# Altium schematic sheet MCU_MKE185F512VLH16.SchDoc: Microcontroller
size A4; DrawnBy: Not Alvin Ha; DocumentNumber: MCU2018-2; Revision: 2.0; SheetNumber: 2; SheetTotal: 4
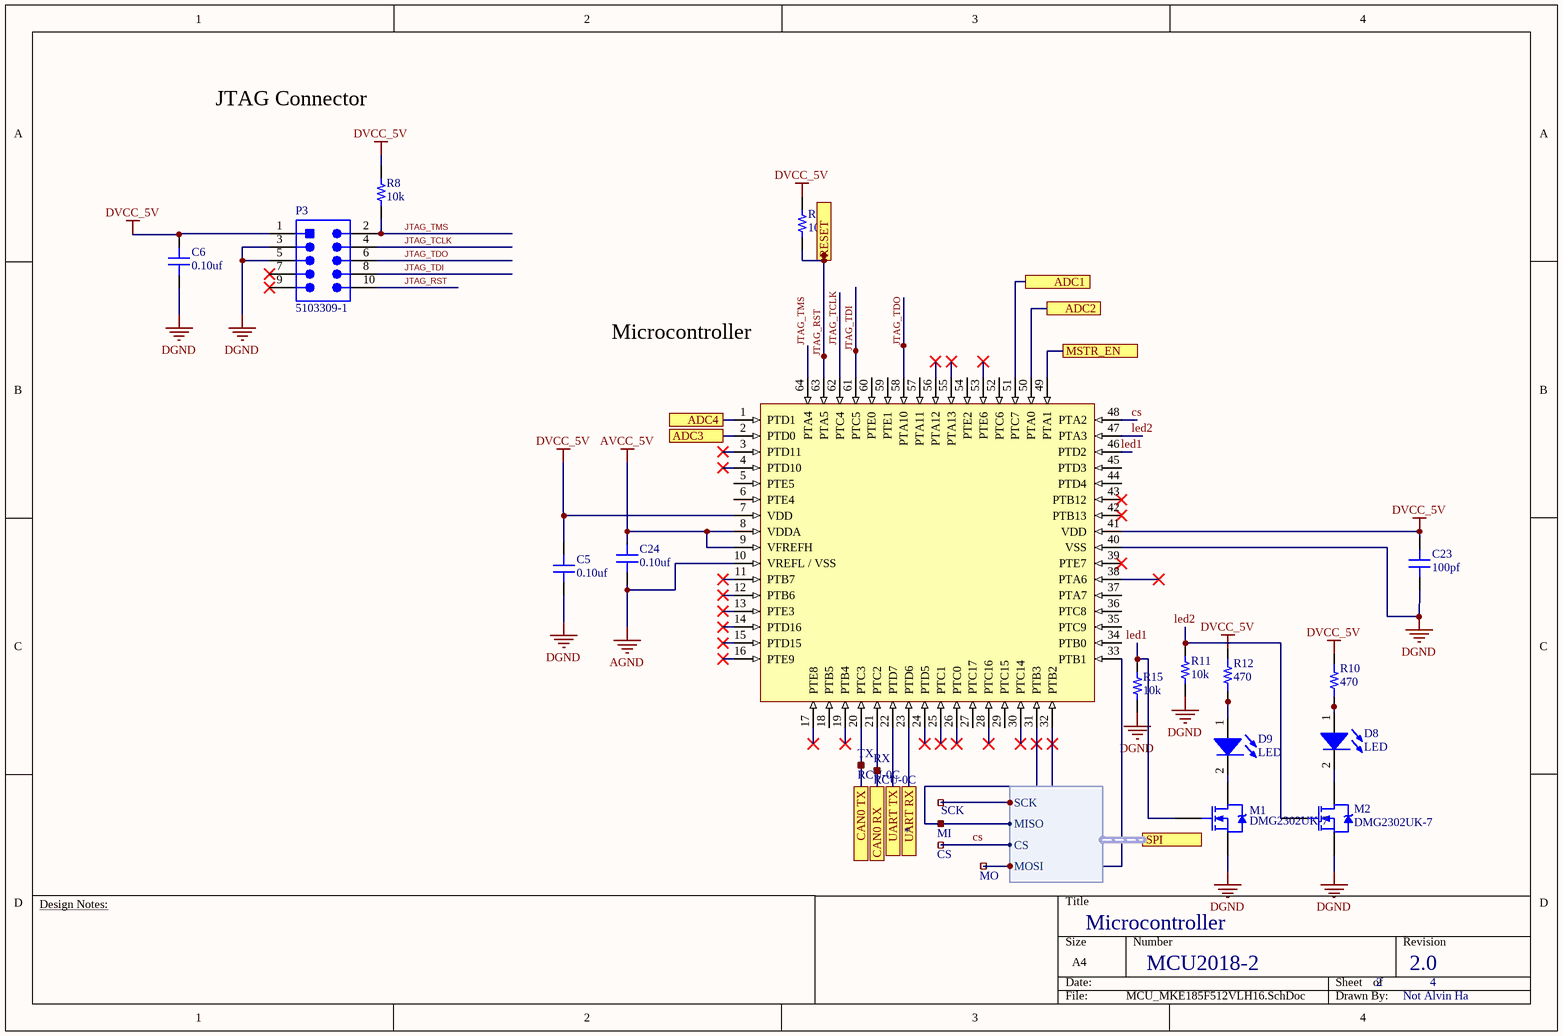
[diagram p0: MCU_MKE185F512VLH16.SchDoc]

## Parts
C5  value 0.10uf  [CAP 0603/1608]  (hidden comment: Capacitor MLCC 0.10uf 25V CAP 0603/1608)
C6  value 0.10uf  [CAP 0603/1608]  (hidden comment: Capacitor MLCC 0.10uf 16V CAP 0603/1608)
C23  value 100pf  [CAP 0603/1608]  (hidden comment: Capacitor MLCC 100pf 25V CAP 0603/1608)
C24  value 0.10uf  [CAP 0603/1608]  (hidden comment: Capacitor MLCC 0.10uf 25V CAP 0603/1608)
CS  RCU-0C  [RCU-0C]  (value not drawn)
D8  LED  [0805_LED]
D9  LED  [0805_LED]
M1  DMG2302UK-7  [SOT23-3]
M2  DMG2302UK-7  [SOT23-3]
MI  RCU-0C  [RCU-0C]  (value not drawn)
MO  RCU-0C  [RCU-0C]  (value not drawn)
P3  5103309-1  [HDR2X5_SMT]
R8  value 10k  [RES 0603/1608]  (hidden comment: Resistor 10k 0603 1/10W 1%)
R9  value 10k  [RES 0603/1608]  (hidden comment: Resistor 10k 0603 1/10W 5%)
R10  value 470  [RES 0603/1608]  (hidden comment: Resistor 470 0603 1/10W 5%)
R11  value 10k  [RES 0603/1608]  (hidden comment: Resistor 10k 0603 1/10W 1%)
R12  value 470  [RES 0603/1608]  (hidden comment: Resistor 470 0603 1/10W 5%)
R15  value 10k  [RES 0603/1608]  (hidden comment: Resistor 10k 0603 1/10W 1%)
RX  RCU-0C  [RCU-0C]
SCK  RCU-0C  [RCU-0C]  (value not drawn)
TX  RCU-0C  [RCU-0C]
U7  (no value)  [TQFP64]

## Ports
ADC1, ADC2, ADC3, ADC4, CAN0 RX, CAN0 TX, MSTR_EN, RESET, SPI (harness *), UART RX, UART TX

## Harnesses
*: SCK, MISO, CS, MOSI

## Nets
AGND: C24.1 U7.10(VREFL_/_VSS)
AVCC_5V: C24.2 U7.8(VDDA) U7.9(VFREFH)
DGND: C5.1 C6.1 C23.1 M1.2(S) M2.2(S) P3.3 P3.5 R11.1 R15.1 U7.40(VSS)
DVCC_5V: C5.2 C6.2 C23.2 P3.1 R8.2 R9.2 R10.2 R12.2 U7.7(VDD) U7.41(VDD)
ADC1: U7.51(PTC7) ; port ADC1
ADC2: U7.50(PTA0) ; port ADC2
ADC3: U7.2(PTD0) ; port ADC3
ADC4: U7.1(PTD1) ; port ADC4
CAN0 RX: RX.1 U7.21(PTC2) ; port CAN0 RX
CAN0 TX: TX.1 U7.20(PTC3) ; port CAN0 TX
cs: CS.1 U7.48(PTA2) ; port SPI.CS
JTAG_RST: P3.10 R9.1 U7.63(PTA5) ; port RESET
JTAG_TCLK: P3.4 U7.62(PTC4)
JTAG_TDI: P3.8 U7.61(PTC5)
JTAG_TDO: P3.6 U7.58(PTA10)
JTAG_TMS: P3.2 R8.1 U7.64(PTA4)
led1: M1.1(G) R15.2 U7.46(PTD2)
led2: M2.1(G) R11.2 U7.47(PTA3)
MSTR_EN: U7.49(PTA1) ; port MSTR_EN
UART RX: U7.23(PTD6) ; port UART RX
UART TX: U7.22(PTD7) ; port UART TX
NetD8_1: D8.1(A) R10.1
NetD8_2: D8.2(K) M2.3(D)
NetD9_1: D9.1(A) R12.1
NetD9_2: D9.2(K) M1.3(D)
NetMI_1: MI.1 U7.31(PTB3) ; port SPI.MISO
NetMO_1: MO.1 U7.33(PTB1) ; port SPI.MOSI
NetSCK_1: SCK.1 U7.32(PTB2) ; port SPI.SCK

Not connected (* = marked no-connect by the designer): P3 7* 9*; U7 3(PTD11)* 4(PTD10)* 5(PTE5) 6(PTE4) 11(PTB7)* 12(PTB6)* 13(PTE3)* 14(PTD16)* 15(PTD15)* 16(PTE9)* 17(PTE8)* 18(PTB5) 19(PTB4)* 24(PTD5)* 25(PTC1)* 26(PTC0)* 27(PTC17) 28(PTC16)* 29(PTC15) 30(PTC14)* 34(PTB0) 35(PTC9) 36(PTC8) 37(PTA7) 38(PTA6)* 39(PTE7)* 42(PTB13)* 43(PTB12)* 44(PTD4) 45(PTD3) 52(PTC6) 53(PTE6)* 54(PTE2) 55(PTA13)* 56(PTA12)* 57(PTA11) 59(PTE1) 60(PTE0)

## Notes on the sheet
- JTAG Connector
- Microcontroller
- Design Notes:

## Library data of the parts
C5 C24 = 583: Manufacturer_id: 1; idCapacitor: 583; Name: Cap_0.10uf_25V_CAP 0603/1608; Dielectric: Ceramic; Created_By: Nick Mah; Drawer_id: 1; Voltage_Rating: 25V; Package: CAP 0603/1608; Created_Date: 10/20/2018
C6 = 223: Manufacturer_id: 1; idCapacitor: 223; Name: Cap_0.10uf_16V_CAP 0603/1608; Dielectric: Ceramic; Created_By: Nick Mah; Drawer_id: 1; Voltage_Rating: 16V; Package: CAP 0603/1608; Created_Date: 10/20/2018
C23 = 529: Manufacturer_id: 1; idCapacitor: 529; Name: Cap_100pf_25V_CAP 0603/1608; Dielectric: Ceramic; Created_By: Nick Mah; Drawer_id: 1; Voltage_Rating: 25V; Package: CAP 0603/1608; Created_Date: 10/20/2018
CS MI MO RX SCK TX = 5: Manufacturer_id: 1; idTable: 5; Name: RCU-0C_Test_Point; Drawer_id: 1; Package: 0603; MfrPartNo: RCU-0C; Link: https://www.digikey.com/product-detail/en/te-connectivity-amp-connectors/RCU-0C/A106145CT-ND/3477802; ComponentLink1Description: Datasheet; ComponentLink1URL: https://www.te.com/commerce/DocumentDelivery/DDEController?Action=srchrtrv&DocNm=1773266&DocType=DS&DocLang=English
D8 D9 = 2: Manufacturer_id: 1; idLED: 2; Name: CMD17_0805_GREEN; Value: Green; Brightness: 7mcd; Id: 20mA; Vf: 2.1V; Drawer_id: 1; Package: 0805; Link: https://www.digikey.com/product-detail/en/visual-communications-company-vcc/CMD17-21VGD-TR8/L62505CT-ND/254936
M1 M2 = 6: MOSFET N-CHANNEL 30V 5A SOT23; Manufacturer_id: 1; idFETs: 6; Value: N_Channel; Vdss: 20V; Id: 2.8A; Rds_On: 90mOhm; Vgs(typ): 800mV; Vgs(Max): 1V; Created_By: Angel; MfrPartNo: DMG2302UK-7; Drawer_id: 1; Name: DMG2302UK-7; Num_Circuits: 1; Package: SOT-23; Link: https://www.digikey.com/product-detail/en/diodes-incorporated/DMG2302UK-7/DMG2302UK-7DICT-ND/6010163; Supplier1: Digi-Key
P3 = 4: 2 row connector; Manufacturer_id: 1; idConn: 4; Name: CONN_TE_2X5POS; Value: CONN; Voltage_Rating: None; Num_Contacts: 10; Num_Rows: 2; Pitch: 2.54mm; Created_By: Aiku; Drawer_id: 1; MfrPartNo: 5103309-1; Link: https://www.digikey.com/product-detail/en/5103309-1/A33160-ND/1114898?utm_campaign=buynow&WT.z_cid=ref_octopart_dkc_buynow&utm_medium=aggregator&curr=usd&site=us&utm_source=octopart; ComponentLink1Description: Datasheet
R8 R11 R15 = 313: Manufacturer_id: 1; idResistor: 313; Name: Res_10k_0603_1/10W_1%; Created_By: Nick Mah; Supplier 1: Digi-Key; Drawer_id: 1; Tolerance: 1%; Power: 1/10W; Package: 0603; ComponentLink1Description: Datasheet; Created_Date: 2018-10-20
R9 = 1393: Manufacturer_id: 1; idResistor: 1393; Name: Res_10k_0603_1/10W_5%; Created_By: Nick Mah; Supplier 1: Digi-Key; Drawer_id: 1; Tolerance: 5%; Power: 1/10W; Package: 0603; ComponentLink1Description: Datasheet; Created_Date: 2018-10-20
R10 R12 = 1361: Manufacturer_id: 1; idResistor: 1361; Name: Res_470_0603_1/10W_5%; Created_By: Nick Mah; Supplier 1: Digi-Key; Drawer_id: 1; Tolerance: 5%; Power: 1/10W; Package: 0603; ComponentLink1Description: Datasheet; Created_Date: 2018-10-20
U7 = 1: idMCU: 1; Name: MKE18F512VLH16 MCU; Manufacturer_id: 1; Drawer_id: 1